# Altium schematic sheet main.SchDoc
size A4; SheetNumber: 1; SheetTotal: 13
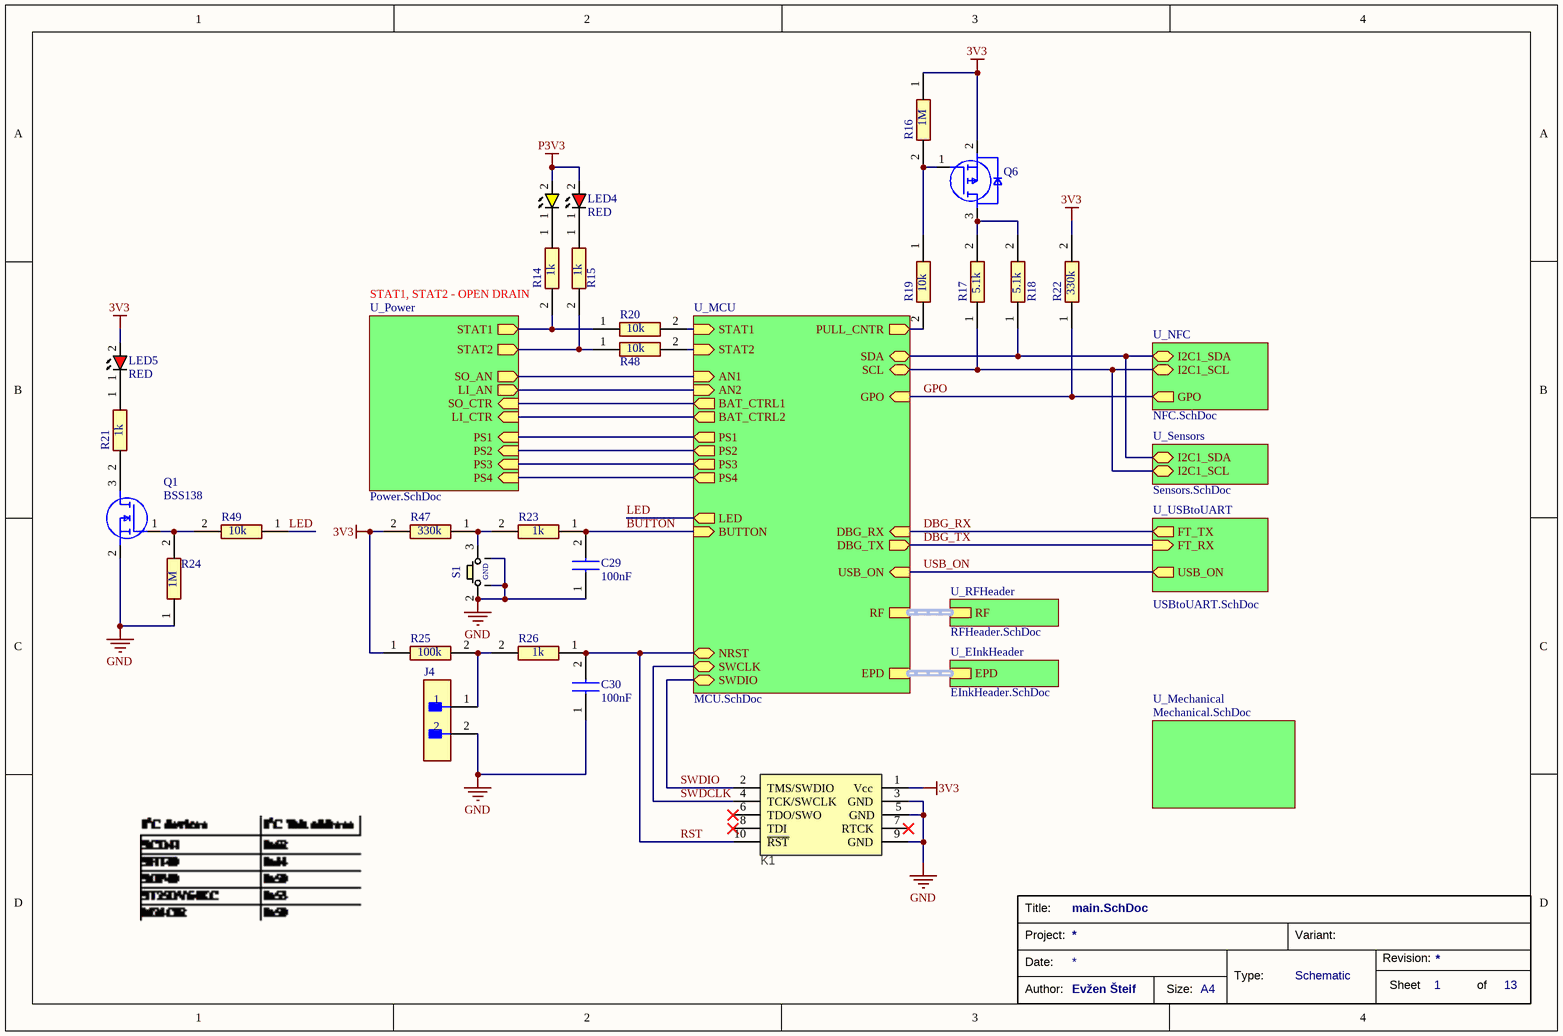
[diagram p0: main.SchDoc]

## Parts
C29  100nF  [CAPC1005X70N]
C30  100nF  [CAPC1005X70N]
J4  M20-9990246  [FP-M20-9990246-MFG]  (value not drawn)
K1  3220-10-0100-00  [TH_CON_MHDR2X5_PIT50_KEY]  (value not drawn)
LED3  150060YS75000  [LEDC1608X80N]  (value not drawn)
LED4  RED  [LEDC1608X80N]
LED5  RED  [LEDC1608X80N]
Q1  BSS138  [SOT95P240X120-3N]
Q6  SSM3J358R,LF  [SOTFL95P240X88-3N]  (value not drawn)
R14  1k  [RESC1005X35N]
R15  1k  [RESC1005X35N]
R16  1M  [RESC1005X40N]
R17  5.1k  [RESC1005X35N]
R18  5.1k  [RESC1005X35N]
R19  10k  [RESC1005X35N]
R20  10k  [RESC1005X35N]
R21  1k  [RESC1005X35N]
R22  330k  [RESC1005X40N]
R23  1k  [RESC1005X35N]
R24  1M  [RESC1005X40N]
R25  100k  [RESC1005X35N]
R26  1k  [RESC1005X35N]
R47  330k  [RESC1005X40N]
R48  10k  [RESC1005X35N]
R49  10k  [RESC1005X35N]
S1  431256038716  [431256038716]  (value not drawn)

## Sub-sheets
U_EInkHeader = EInkHeader.SchDoc: EPD (harness E1)
U_MCU = MCU.SchDoc: SWDIO (bidir), SWCLK (bidir), NRST (bidir), RF (harness RF_HARNESS), EPD (harness EPD_HARNESS), SCL (bidir), SDA (bidir), AN1 (in), AN2 (in), DBG_TX (out), DBG_RX (in), USB_ON (in), PS1 (out), PS2 (out), PS3 (out), PS4 (out), GPO (in), BUTTON (in), LED (out), STAT1 (in), STAT2 (in), BAT_CTRL1 (out), BAT_CTRL2 (out), PULL_CNTR (out)
U_Mechanical = Mechanical.SchDoc: no entries
U_NFC = NFC.SchDoc: GPO (out), I2C1_SCL (bidir), I2C1_SDA (bidir)
U_Power = Power.SchDoc: PS1 (in), PS2 (in), PS3 (in), LI_AN (out), SO_AN (out), LI_CTR (in), SO_CTR (in), PS4 (in), STAT1 (out), STAT2 (out)
U_RFHeader = RFHeader.SchDoc: RF (harness RF_HARNESS1)
U_Sensors = Sensors.SchDoc: I2C1_SDA (bidir), I2C1_SCL (bidir)
U_USBtoUART = USBtoUART.SchDoc: FT_TX (out), FT_RX (in), USB_ON (out)

## Nets
3V3: K1.1(Vcc) LED5.2(A) Q6.2(S) R16.1 R22.2 R25.1 R47.2
GND: C29.1 C30.1 J4.2 K1.3(GND) K1.5(GND) K1.9(GND) Q1.2(S) R24.1 S1.1 S1.2 S1.4
P3V3: LED3.2(A) LED4.2(A)
BUTTON: C29.2 R23.1 ; sheet U_MCU/BUTTON
DBG_RX: sheet U_USBtoUART/FT_TX, sheet U_MCU/DBG_RX
DBG_TX: sheet U_USBtoUART/FT_RX, sheet U_MCU/DBG_TX
GPO: R22.1 ; sheet U_NFC/GPO, sheet U_MCU/GPO
LED: R49.1 ; sheet U_MCU/LED
RST: C30.2 K1.10(~{RST}) R26.1 ; sheet U_MCU/NRST
SWDCLK: K1.4(TCK/SWCLK) ; sheet U_MCU/SWCLK
SWDIO: K1.2(TMS/SWDIO) ; sheet U_MCU/SWDIO
USB_ON: sheet U_USBtoUART/USB_ON, sheet U_MCU/USB_ON
NetJ4_1: J4.1 R25.2 R26.2
NetLED3_1: LED3.1(K) R14.1
NetLED4_1: LED4.1(K) R15.1
NetLED5_1: LED5.1(K) R21.1
NetQ1_1: Q1.1(G) R24.2 R49.2
NetQ1_3: Q1.3(D) R21.2
NetQ6_1: Q6.1(G) R16.2 R19.1
NetQ6_3: Q6.3(D) R17.2 R18.2
NetR14_2: R14.2 R20.1 ; sheet U_Power/STAT1
NetR15_2: R15.2 R48.1 ; sheet U_Power/STAT2
NetR17_1: R17.1 ; sheet U_Sensors/I2C1_SCL, sheet U_NFC/I2C1_SCL, sheet U_MCU/SCL
NetR18_1: R18.1 ; sheet U_Sensors/I2C1_SDA, sheet U_NFC/I2C1_SDA, sheet U_MCU/SDA
NetR19_2: R19.2 ; sheet U_MCU/PULL_CNTR
NetR20_2: R20.2 ; sheet U_MCU/STAT1
NetR23_2: R23.2 R47.1 S1.3
NetR48_2: R48.2 ; sheet U_MCU/STAT2
(unnamed): sheet U_MCU/AN1, sheet U_Power/SO_AN
(unnamed): sheet U_MCU/AN2, sheet U_Power/LI_AN
(unnamed): sheet U_MCU/PS1, sheet U_Power/PS1
(unnamed): sheet U_MCU/PS2, sheet U_Power/PS2
(unnamed): sheet U_MCU/PS3, sheet U_Power/PS3
(unnamed): sheet U_MCU/PS4, sheet U_Power/PS4
(unnamed): sheet U_MCU/BAT_CTRL1, sheet U_Power/SO_CTR
(unnamed): sheet U_MCU/BAT_CTRL2, sheet U_Power/LI_CTR

Not connected (* = marked no-connect by the designer): K1 6(TDO/SWO)* 7(RTCK)* 8(TDI)*

## Buses and harness runs
harness sheet U_EInkHeader/EPD = sheet U_MCU/EPD
harness sheet U_MCU/RF = sheet U_RFHeader/RF

## Notes on the sheet
- (near R14) STAT1, STAT2 - OPEN DRAIN
- Title:
- Date:
- Project:
- Type:
- Schematic
- Variant:
- Revision:
- Sheet
- of
- Author:
- Evžen Šteif
- Size:
- A4
- (in symbol 431256038716) GND

## Library data of the parts
C29 C30 = GRM155R61A104KA01D: Capacitor; Manufacturer_Name: Murata Electronics; Datasheet Link: https://search.murata.co.jp/Ceramy/image/img/A01X/G101/ENG/GRM155R61A104KA01-02A.pdf; Height: 0.7mm; Manufacturer_Part_Number: GRM155R61A104KA01D; Mouser Part Number: 81-GRM155R61A104KA01; Mouser Price/Stock: https://www.mouser.co.uk/ProductDetail/Murata-Electronics/GRM155R61A104KA01D?qs=5bAuhL3RhmNZw0v59AqOJA%3D%3D; Arrow Part Number: GRM155R61A104KA01D; Arrow Price/Stock: https://www.arrow.com/en/products/grm155r61a104ka01d/murata-manufacturing?utm_currency=USD&region=europe
J4 = CMP-15831-000009-1: CONN HEADER VERT 2POS 2.54MM; Manufacturer: Harwin; Conn Gender: Male; Conn Orientation: Vertical; Number Of Contacts: 2; Current Rating: 3A; ComponentLink2URL: https://cdn.harwin.com/pdfs/M20-999.pdf; ComponentLink2Description: Datasheet; Package: M20-9990246; Temperature: -40°C to +105°C; Octopart: https://octopart.com/m20-9990246-harwin-2590635; Mouser Description: 2.54mm (0.1") Pitch SIL Vertical PC Tail Pin Header, 6.1mm mating pin height, tin, 2 contacts; Temperature Range High: +105°C; Device Class L1: Connectors; RoHS: TRUE; Automotive: No; Height: 8.99mm; Number Of Rows: 1; Contact Material: Tin,Nickel; Category: Conn; Pitch: 2.54mm; Lead Free: Yes; Digikey Description: CONN HEADER VERT 2POS 2.54MM; Manufacturer Part Number: M20-9990246; Temperature Range Low: -40°C; Device Class L3: unset; Device Class L2: Headers and Wire Housings
K1 = TEST_00015: Cortex ARM JTAG 10 Pin, Header; Manufacturer: CNC Tech; Autor: Krutina; Id: 15; Designer: Krahulec; Active: 1; Validated in design: 0; Count: 585; Generic_replacement: No; LE_Price: 0.363527; Location: LE; Sourcing: Manufacturer; Value: ARM JTAG 10; LastRevisionDate: 28.7.2015; PartNumber: TEST_00015; Technology: THT; Librarian: Krahulec; Supplier 1: Digi-Key; Supplier Part Number 1: 1175-1627-ND; ComponentLink1URL: http://www.cnctech.us/; ComponentLink1Description: Manufacturer Web; Cat1: JTAG; Cat2: ARM; ROHS: 1; Jablotron_Price: 0; Manufacturer Part Number: 3220-10-0100-00
LED3 = 150060YS75000: LED; Manufacturer_Name: Wurth Elektronik; Datasheet Link: http://uk.rs-online.com/web/p/products/8154219; Height: 0.8mm; Manufacturer_Part_Number: 150060YS75000; Mouser Part Number: 710-150060YS75000; Mouser Price/Stock: https://www.mouser.co.uk/ProductDetail/Wurth-Elektronik/150060YS75000?qs=LlUlMxKIyB0nKmwefHgtZw%3D%3D
LED4 LED5 = 150060RS55040: LED; Manufacturer_Name: Wurth Elektronik; Manufacturer_Part_Number: 150060RS75000; Datasheet Link: https://componentsearchengine.com/Datasheets/2/150060GS75000.pdf; Height: 0.8mm; Mouser Part Number: 710-150060RS75000; Mouser Price/Stock: https://www.mouser.co.uk/ProductDetail/Wurth-Elektronik/150060GS75000?qs=LlUlMxKIyB0UYkq5lDO8nA%3D%3D
Q1 = BSS138: MOSFET (N-Channel); Manufacturer_Name: onsemi; Datasheet Link: https://www.onsemi.com/pub/Collateral/BSS138-D.PDF; Height: 1.2mm; Manufacturer_Part_Number: BSS138; Mouser Part Number: 512-BSS138; Mouser Price/Stock: https://www.mouser.co.uk/ProductDetail/onsemi-Fairchild/BSS138?qs=HK%252BeIG1iaahCeqBvjB4arg%3D%3D; Arrow Part Number: BSS138; Arrow Price/Stock: https://www.arrow.com/en/products/bss138/on-semiconductor?utm_currency=USD&region=europe
Q6 = SSM3J358R,LF: MOSFET (P-Channel); Manufacturer_Name: Toshiba; Datasheet Link: https://toshiba.semicon-storage.com/ap-en/product/mosfet/detail.SSM3J358R.html; Height: 0.88mm; Manufacturer_Part_Number: SSM3J358R,LF; Mouser Part Number: 757-SSM3J358RLF; Mouser Price/Stock: https://www.mouser.co.uk/ProductDetail/Toshiba/SSM3J358RLF?qs=HXFqYaX1Q2xwvCtt1GGmkw%3D%3D; Arrow Part Number: SSM3J358R,LF; Arrow Price/Stock: https://www.arrow.com/en/products/ssm3j358rlf/toshiba?region=nac
R14 R15 R21 R23 R26 = RT0402FRE071KL: Resistor; Manufacturer_Name: KEMET; Datasheet Link: https://www.yageo.com/upload/media/product/productsearch/datasheet/rchip/PYu-RT_1-to-0.01_RoHS_L_11.pdf; Height: 0.35mm; Manufacturer_Part_Number: RT0402FRE071KL; Mouser Part Number: RT0402FRE071KL; Mouser Price/Stock: https://www.mouser.co.uk/ProductDetail/YAGEO/RT0402FRE07100KL?qs=BXCcY9r%252B08CxTvf5JB1kiw%3D%3D; Arrow Part Number: RT0402FRE07100KL; Arrow Price/Stock: https://www.arrow.com/en/products/rt0402fre07100kl/yageo
R16 R24 = RC0402FR-071ML: Resistor; Manufacturer_Name: YAGEO; Datasheet Link: https://componentsearchengine.com/Datasheets/2/RC0402FR-071ML.pdf; Height: 0.4mm; Manufacturer_Part_Number: RC0402FR-071ML; Mouser Part Number: 603-RC0402FR-071ML; Mouser Price/Stock: https://www.mouser.co.uk/ProductDetail/YAGEO/RC0402FR-071ML?qs=V1yeUXFNrknfoI4987wfBQ%3D%3D; Arrow Part Number: RC0402FR-071ML; Arrow Price/Stock: https://www.arrow.com/en/products/rc0402fr-071ml/yageo?region=nac
R17 R18 = RT0402FRE075K1L: Resistor; Manufacturer_Name: YAGEO; Datasheet Link: https://www.yageo.com/upload/media/product/app/datasheet/rchip/pyu-rt_1-to-0.01_rohs_l.pdf; Height: 0.35mm; Manufacturer_Part_Number: RT0402FRE075K1L; Mouser Part Number: RT0402FRE075K1L; Mouser Price/Stock: https://www.mouser.co.uk/ProductDetail/YAGEO/RT0402FRE07100RL?qs=BXCcY9r%252B08AcvLZjF7vcwQ%3D%3D
R19 R20 R48 R49 = RT0402FRE0710KL: Resistor; Manufacturer_Name: KEMET; Datasheet Link: https://cz.mouser.com/datasheet/2/447/PYu_RT_1_to_0_01_RoHS_L_15-3461507.pdf; Height: 0.35mm; Manufacturer_Part_Number: RT0402FRE0710KL; Mouser Part Number: 603-RT0402FRE0710KL; Mouser Price/Stock: https://www.mouser.co.uk/ProductDetail/YAGEO/RT0402FRE07100KL?qs=BXCcY9r%252B08CxTvf5JB1kiw%3D%3D; Arrow Part Number: RT0402FRE07100KL; Arrow Price/Stock: https://www.arrow.com/en/products/rt0402fre07100kl/yageo
R22 R47 = RC0402BR-07330KL: Resistor; Manufacturer_Name: YAGEO; Datasheet Link: https://cz.mouser.com/datasheet/2/447/PYu_RC_Group_51_RoHS_L_11-1984063.pdf; Height: 0.4mm; Manufacturer_Part_Number: RC0402BR-07330KL
R25 = RT0402FRE07100KL: Resistor; Manufacturer_Name: KEMET; Datasheet Link: https://www.yageo.com/upload/media/product/productsearch/datasheet/rchip/PYu-RT_1-to-0.01_RoHS_L_11.pdf; Height: 0.35mm; Manufacturer_Part_Number: RT0402FRE07100KL; Mouser Part Number: 603-RT0402FRE07100KL; Mouser Price/Stock: https://www.mouser.co.uk/ProductDetail/YAGEO/RT0402FRE07100KL?qs=BXCcY9r%252B08CxTvf5JB1kiw%3D%3D; Arrow Part Number: RT0402FRE07100KL; Arrow Price/Stock: https://www.arrow.com/en/products/rt0402fre07100kl/yageo
S1 = 431256038716: Switch; Manufacturer_Name: Wurth Elektronik; Datasheet Link: https://www.we-online.com/components/products/datasheet/431256038716.pdf; Height: 7.2mm; Manufacturer_Part_Number: 431256038716; Mouser Part Number: 710-431256038716; Mouser Price/Stock: https://www.mouser.co.uk/ProductDetail/Wurth-Elektronik/431256038716?qs=2kOmHSv6VfR5N0FN9BhJ6g%3D%3D